# EAGLE design RobotArm (EAGLE 7.6.0)
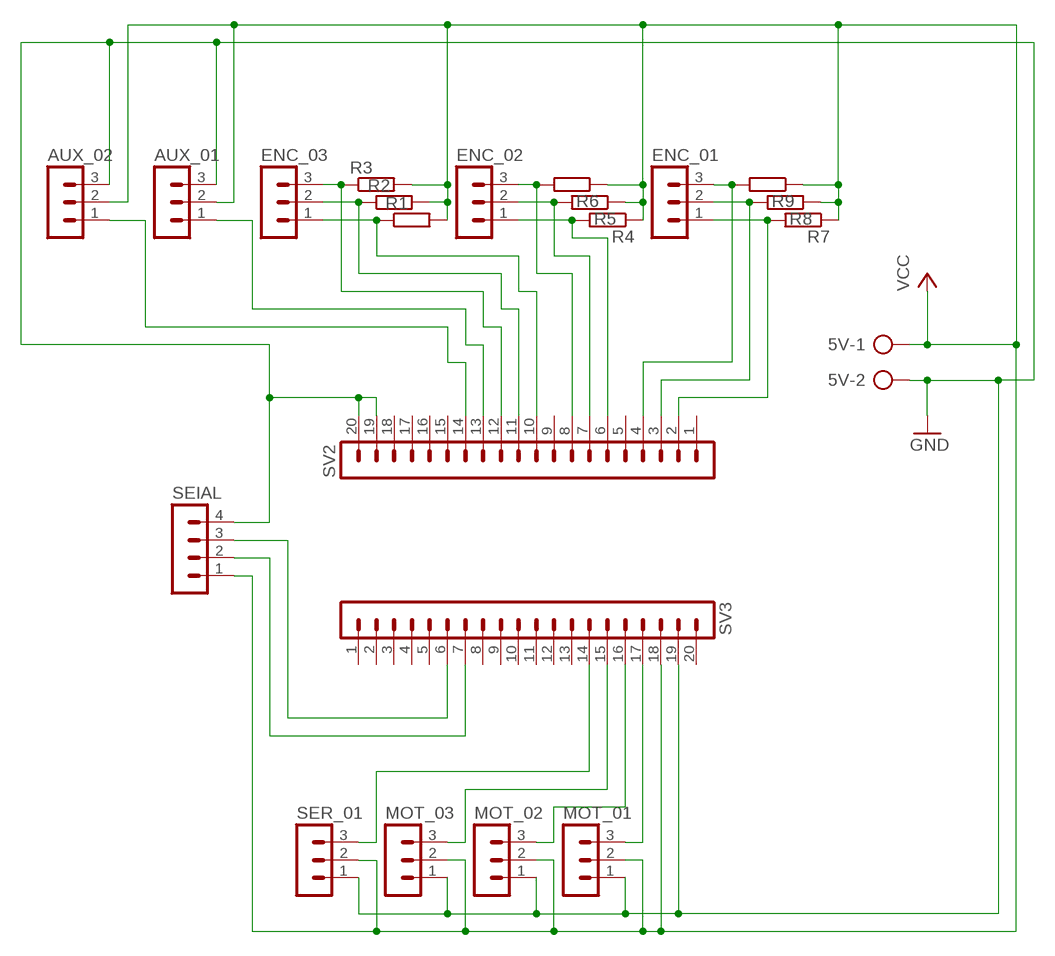
[diagram p0: schematic, sheet 1]

## Parts
5V  AK500/2-H  [AK500/2-H]
AUX_01  MA03-1  [MA03-1]
AUX_02  MA03-1  [MA03-1]
ENC_01  MA03-1  [MA03-1]
ENC_02  MA03-1  [MA03-1]
ENC_03  MA03-1  [MA03-1]
MOT_01  MA03-1  [MA03-1]
MOT_02  MA03-1  [MA03-1]
MOT_03  MA03-1  [MA03-1]
R1  R-EU_0207/10  [0207/10]
R2  R-EU_0207/10  [0207/10]
R3  R-EU_0207/10  [0207/10]
R4  R-EU_0207/10  [0207/10]
R5  R-EU_0207/10  [0207/10]
R6  R-EU_0207/10  [0207/10]
R7  R-EU_0207/10  [0207/10]
R8  R-EU_0207/10  [0207/10]
R9  R-EU_0207/10  [0207/10]
SEIAL  MA04-1  [MA04-1]
SER_01  MA03-1  [MA03-1]
SV2  MA20-1  [MA20-1]
SV3  MA20-1  [MA20-1]

## Nets
GND: 5V.2 AUX_01.3 AUX_02.3 MOT_01.1 MOT_02.1 MOT_03.1 SEIAL.4 SER_01.1 SV2.19 SV2.20 SV3.19
N$4: ENC_01.3 R9.2 SV2.4
N$6: ENC_01.2 R8.2 SV2.3
N$7: ENC_01.1 R7.2 SV2.2
N$8: ENC_02.3 R6.2 SV2.8
N$9: ENC_02.2 R5.2 SV2.7
N$10: ENC_02.1 R4.2 SV2.6
N$11: ENC_03.3 R3.1 SV2.12
N$12: ENC_03.2 R2.1 SV2.11
N$13: ENC_03.1 R1.1 SV2.10
N$14: AUX_01.1 SV2.13
N$15: AUX_02.1 SV2.14
N$16: MOT_01.3 SV3.17
N$17: MOT_02.3 SV3.16
N$18: MOT_03.3 SV3.15
N$19: SER_01.3 SV3.14
N$22: SEIAL.2 SV3.7
N$23: SEIAL.3 SV3.6
VCC: 5V.1 AUX_01.2 AUX_02.2 MOT_01.2 MOT_02.2 MOT_03.2 R1.2 R2.2 R3.2 R4.1 R5.1 R6.1 R7.1 R8.1 R9.1 SEIAL.1 SER_01.2 SV3.18
Unconnected: SV2.1 SV2.5 SV2.9 SV2.15 SV2.16 SV2.17 SV2.18 SV3.1 SV3.2 SV3.3 SV3.4 SV3.5 SV3.8 SV3.9 SV3.10 SV3.11 SV3.12 SV3.13 SV3.20

## Library data of the parts
5V = con-ptr500:AK500/2-H: CONNECTOR Aug. 2004 / PTR Meßtechnik: Die Bezeichnung der Serie AK505 wurde geändert. Es handelt sich hierbei um AK500 in horizontaler Ausführung.; OC_FARNELL: unknown; OC_NEWARK: unknown
AUX_01 AUX_02 ENC_01-ENC_03 MOT_01-MOT_03 SER_01 = con-lstb:MA03-1: PIN HEADER; OC_FARNELL: unknown; OC_NEWARK: unknown
R1-R9 = rcl:R-EU_: RESISTOR, European symbol
SEIAL = con-lstb:MA04-1: PIN HEADER; OC_FARNELL: unknown; OC_NEWARK: unknown
SV2 SV3 = con-lstb:MA20-1: PIN HEADER; OC_FARNELL: unknown; OC_NEWARK: unknown

## Board
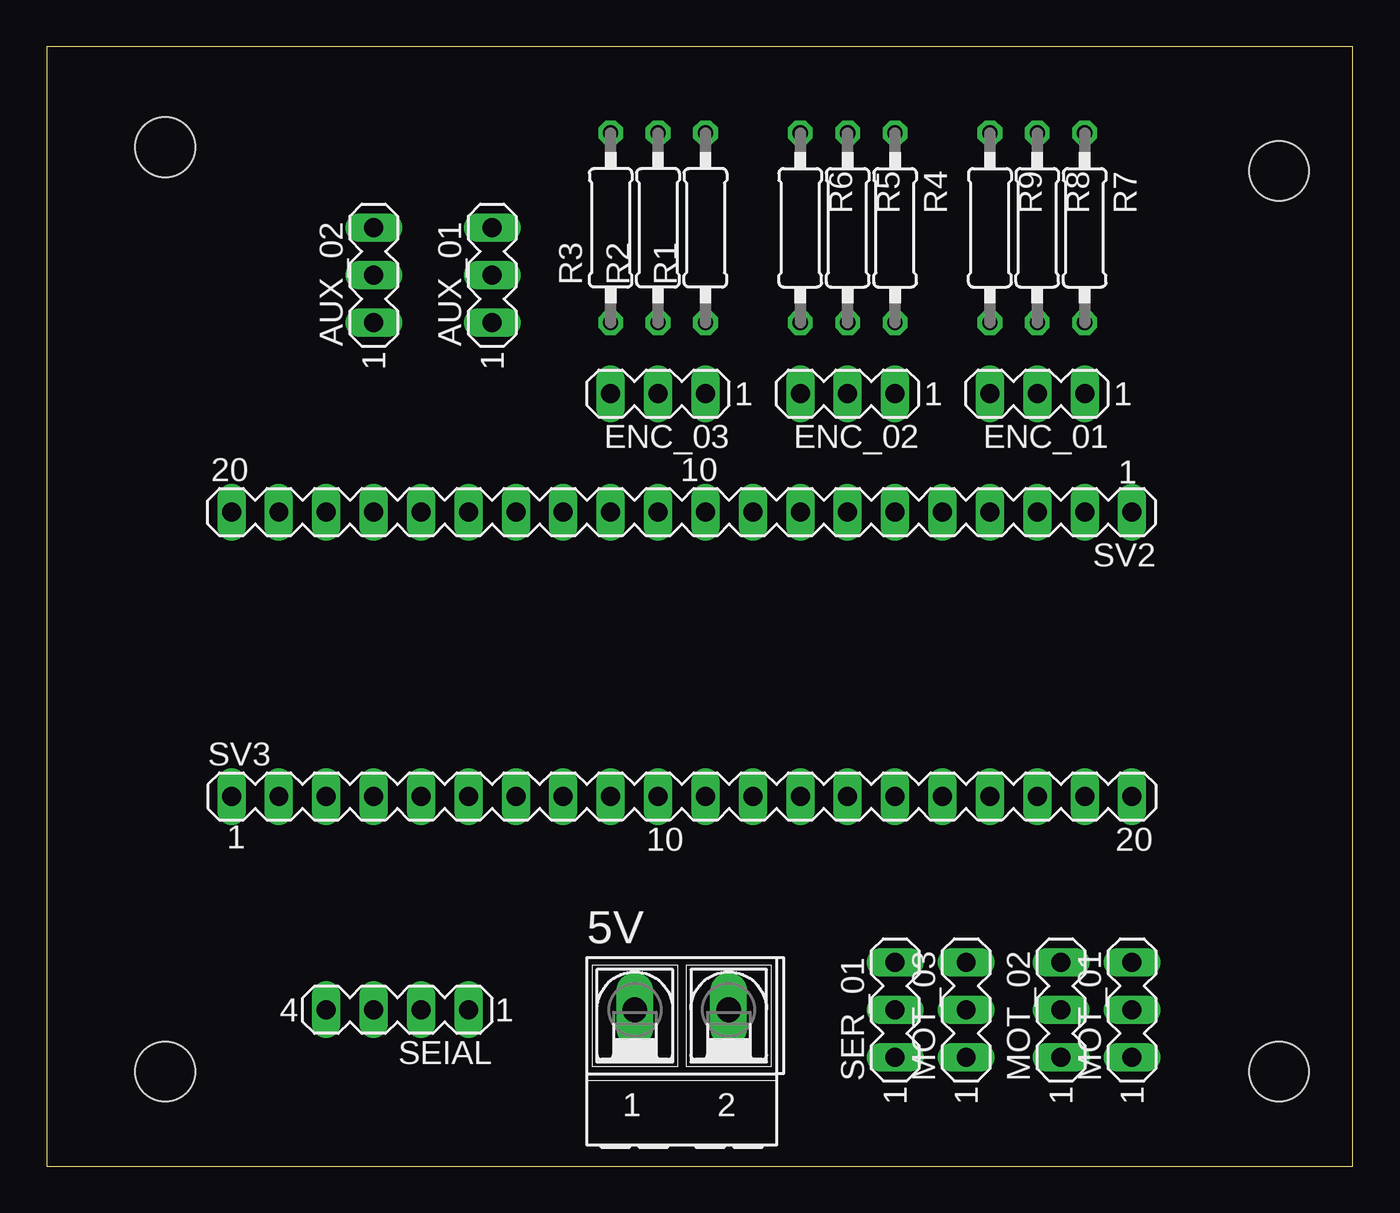
[diagram p1: board, top side]
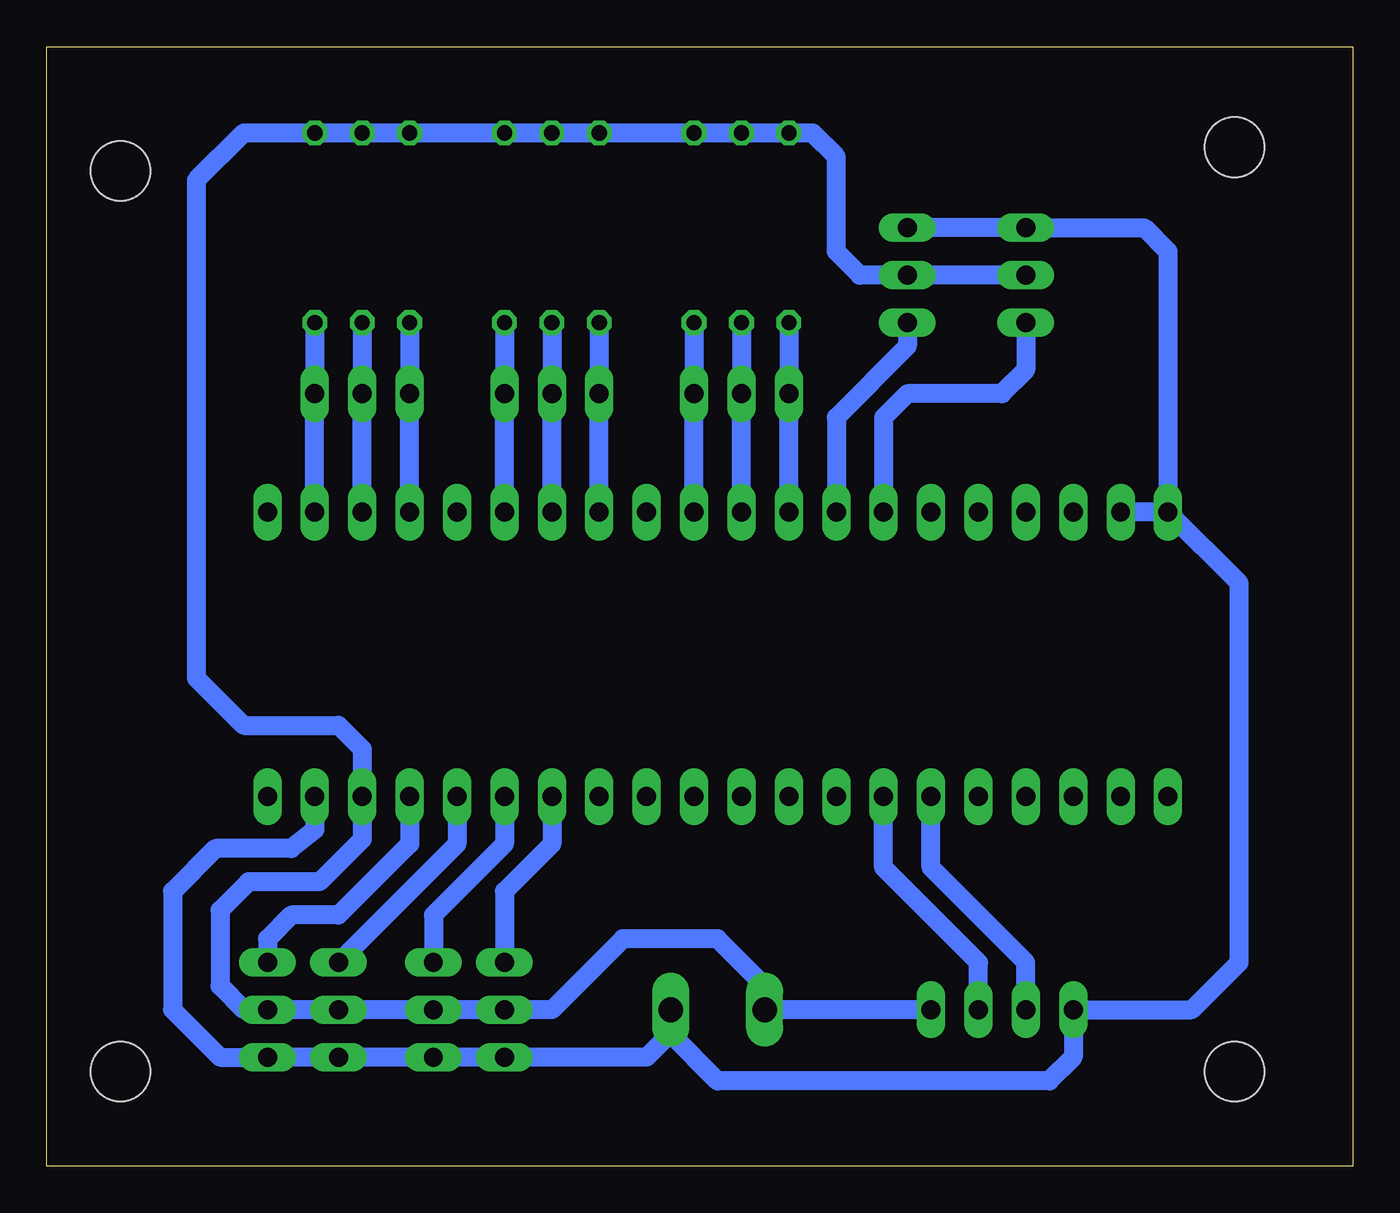
[diagram p2: board, bottom side, seen from below]

Size 70 x 60 mm. Coordinates in mm from the lower left corner, seen from the top.
Outline: 0,0 70,0 70,60 0,60 0,0
Copper layers (1*16): Top 0.035mm / dielectric 1.5mm / Bottom 0.035mm
Design rules "default": minimum track width 10mil, minimum drill 24mil, track to track 8mil, track to pad 8mil, pad to pad 8mil, via to via 8mil, smd to smd 8mil, copper to edge 40mil, drill to drill 8mil, minimum pad ring 10mil, minimum via ring 8mil, stop-mask expansion 4mil, vias tented up to drill 0mil, thermal gap 10mil
Holes 3.2 mm at 6.35,54.61 66.04,53.34 66.04,5.08 6.35,5.08

### Footprints (pad centres in the part's own frame; a part is rotated, then mirrored left to right if it is on the bottom)
AK500/2-H = drill 1.321 long: 1 -2.515,0; 2 2.515,0
MA03-1 = drill 1.016 long: 1 -2.54,0; 2 0,0; 3 2.54,0
0207/10 = drill 0.813 octagon: 1 -5.08,0; 2 5.08,0
MA04-1 = drill 1.016 long: 1 -3.81,0; 2 -1.27,0; 3 1.27,0; 4 3.81,0
MA20-1 = drill 1.016 long: 1 -24.13,0; 2 -21.59,0; 3 -19.05,0; 4 -16.51,0; 5 -13.97,0; 6 -11.43,0; 7 -8.89,0; 8 -6.35,0; 9 -3.81,0; 10 -1.27,0; 11 1.27,0; 12 3.81,0; 13 6.35,0; 14 8.89,0; 15 11.43,0; 16 13.97,0; 17 16.51,0; 18 19.05,0; 19 21.59,0; 20 24.13,0

### Placement (x,y rotation side)
5V  34.04,8.38 0 top
AUX_01  23.88,47.75 90 top
AUX_02  17.53,47.75 90 top
ENC_01  53.09,41.4 180 top
ENC_02  42.93,41.4 180 top
ENC_03  32.77,41.4 180 top
MOT_01  58.17,8.38 90 top
MOT_02  54.36,8.38 90 top
MOT_03  49.28,8.38 90 top
R1  35.31,50.29 90 top
R2  32.77,50.29 90 top
R3  30.23,50.29 90 top
R4  45.47,50.29 270 top
R5  42.93,50.29 270 top
R6  40.39,50.29 270 top
R7  55.63,50.29 270 top
R8  53.09,50.29 270 top
R9  50.55,50.29 270 top
SEIAL  18.8,8.38 180 top
SER_01  45.47,8.38 90 top
SV2  34.04,35.05 180 top
SV3  34.04,19.81 0 top

### Tracks (layer width: path | path; a pad name or v marks a point on that pad's centre or on a via)
GND
  Bottom 0.406: 36.55,7.14 36.58,7.11
  Bottom 1.016: AUX_01.3 AUX_02.3 11.18,50.29 9.91,49.02 SV2.20 | 5V.2 36.55,7.14 | SV3.19 55.63,18.03 56.9,17.02 60.96,17.02 63.25,14.73 63.25,8.38 60.71,5.84 MOT_01.1 MOT_02.1 MOT_03.1 SER_01.1 37.85,5.84 36.58,7.11 34.04,4.57 16.26,4.57 14.99,5.84 SEIAL.4 8.64,8.38 6.1,10.92 6.1,31.24 SV2.20 | SV2.20 SV2.19
N$4
  Bottom 1.016: R9.2 ENC_01.3 SV2.4
N$6
  Bottom 1.016: R8.2 ENC_01.2 SV2.3
N$7
  Bottom 1.016: R7.2 ENC_01.1 SV2.2
N$8
  Bottom 1.016: R6.2 ENC_02.3 SV2.8
N$9
  Bottom 1.016: R5.2 ENC_02.2 SV2.7
N$10
  Bottom 1.016: R4.2 ENC_02.1 SV2.6
N$11
  Bottom 1.016: R3.1 ENC_03.3 SV2.12
N$12
  Bottom 1.016: R2.1 ENC_03.2 SV2.11
N$13
  Bottom 1.016: R1.1 ENC_03.1 SV2.10
N$14
  Bottom 1.016: AUX_01.1 23.88,43.94 27.69,40.13 SV2.13
N$15
  Bottom 1.016: AUX_02.1 17.53,42.67 18.8,41.4 23.88,41.4 25.15,40.13 SV2.14
N$16
  Bottom 1.016: SV3.17 50.55,17.27 54.36,13.46 56.9,13.46 58.17,12.19 MOT_01.3
N$17
  Bottom 1.016: SV3.16 48.01,17.27 MOT_02.3
N$18
  Bottom 1.016: SV3.15 45.47,17.27 49.28,13.46 MOT_03.3
N$19
  Bottom 1.016: SV3.14 42.93,17.27 45.47,14.73 SER_01.3
N$22
  Bottom 1.016: SEIAL.2 20.07,10.92 25.15,16 SV3.7
N$23
  Bottom 1.016: SEIAL.3 17.53,10.92 22.61,16 SV3.6
VCC
  Bottom 1.016: SEIAL.1 5V.1 31.52,9.68 34.04,12.19 39.12,12.19 42.93,8.38 SER_01.2 MOT_03.2 MOT_02.2 MOT_01.2 59.44,8.38 60.71,9.65 60.71,13.72 59.18,15.24 55.37,15.24 53.09,17.53 SV3.18 53.09,22.35 54.36,23.62 59.44,23.62 61.98,26.16 61.98,52.83 59.44,55.37 R7.1 R8.1 R9.1 R4.1 R5.1 R6.1 R1.2 R2.2 R3.2 28.96,55.37 27.69,54.1 27.69,49.02 26.42,47.75 AUX_01.2 AUX_02.2